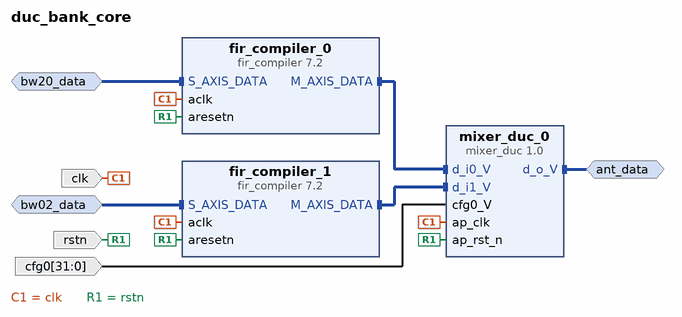
[diagram p0: block diagram of the top level]
# Vivado block design duc_bank_core, xc7z045ffg900-2, Vivado 2017.4.1
create_bd_design duc_bank_core

create_bd_intf_port -mode Slave -vlnv xilinx.com:interface:axis_rtl:1.0 bw20_data
set_property -dict [list \
  CONFIG.TDATA_NUM_BYTES 8 \
  CONFIG.TDEST_WIDTH 0 \
  CONFIG.TID_WIDTH 0 \
  CONFIG.TUSER_WIDTH 0 \
  CONFIG.HAS_TREADY 1 \
  CONFIG.HAS_TSTRB 0 \
  CONFIG.HAS_TKEEP 0 \
  CONFIG.HAS_TLAST 0 \
  CONFIG.FREQ_HZ 200000000 \
  CONFIG.LAYERED_METADATA undef \
] [get_bd_intf_ports bw20_data]
create_bd_intf_port -mode Slave -vlnv xilinx.com:interface:axis_rtl:1.0 bw02_data
set_property -dict [list \
  CONFIG.TDATA_NUM_BYTES 16 \
  CONFIG.TDEST_WIDTH 0 \
  CONFIG.TID_WIDTH 0 \
  CONFIG.TUSER_WIDTH 0 \
  CONFIG.HAS_TREADY 1 \
  CONFIG.HAS_TSTRB 0 \
  CONFIG.HAS_TKEEP 0 \
  CONFIG.HAS_TLAST 0 \
  CONFIG.FREQ_HZ 200000000 \
  CONFIG.LAYERED_METADATA undef \
] [get_bd_intf_ports bw02_data]
create_bd_intf_port -mode Master -vlnv xilinx.com:interface:acc_fifo_write_rtl:1.0 ant_data
create_bd_port -dir I -type clk clk
set_property -dict {CONFIG.FREQ_HZ 200000000 CONFIG.ASSOCIATED_BUSIF bw20_data:bw02_data} [get_bd_ports clk]
create_bd_port -dir I -type rst rstn
create_bd_port -dir I -from 31 -to 0 -type data cfg0
set_property -dict [list \
  CONFIG.LAYERED_METADATA {xilinx.com:interface:datatypes:1.0 {DATA {datatype {name {attribs {resolve_type immediate dependency {} format string minimum {} maximum {}} value {}} bitwidth {attribs {resolve_type immediate dependency {} format long minimum {} maximum {}} value 32} bitoffset {attribs {resolve_type immediate dependency {} format long minimum {} maximum {}} value 0} integer {signed {attribs {resolve_type immediate dependency {} format bool minimum {} maximum {}} value true}}}}}} \
] [get_bd_ports cfg0]

create_bd_cell -type ip -vlnv xilinx.com:ip:fir_compiler:7.2 fir_compiler_0
set_property -dict [list \
  CONFIG.CoefficientVector 235,-37,-181,-98,130,118,-169,-257,74,315,-2,-418,-181,429,371,-409,-637,256,899,12,-1183,-499,1424,1309,-1631,-2989,1754,10259,14579,10259,1754,-2989,-1631,1309,1424,-499,-1183,12,899,256,-637,-409,371,429,-181,-418,-2,315,74,-257,-169,118,130,-98,-181,-37,235 \
  CONFIG.Coefficient_Sets 1 \
  CONFIG.Filter_Type Interpolation \
  CONFIG.Interpolation_Rate 2 \
  CONFIG.Decimation_Rate 1 \
  CONFIG.Zero_Pack_Factor 1 \
  CONFIG.Number_Channels 1 \
  CONFIG.Number_Paths 4 \
  CONFIG.RateSpecification Output_Sample_Period \
  CONFIG.SamplePeriod 4 \
  CONFIG.Sample_Frequency 0.001 \
  CONFIG.Clock_Frequency 300.0 \
  CONFIG.Coefficient_Sign Signed \
  CONFIG.Quantization Integer_Coefficients \
  CONFIG.Coefficient_Width 16 \
  CONFIG.Coefficient_Fractional_Bits 0 \
  CONFIG.Coefficient_Structure Symmetric \
  CONFIG.Data_Width 16 \
  CONFIG.Output_Rounding_Mode Symmetric_Rounding_to_Infinity \
  CONFIG.Output_Width 16 \
  CONFIG.Filter_Architecture Systolic_Multiply_Accumulate \
  CONFIG.ColumnConfig 4 \
  CONFIG.M_DATA_Has_TREADY true \
  CONFIG.Has_ARESETn true \
] [get_bd_cells fir_compiler_0]
create_bd_cell -type ip -vlnv xilinx.com:ip:fir_compiler:7.2 fir_compiler_1
set_property -dict [list \
  CONFIG.CoefficientVector 67,41,48,51,50,43,29,10,-15,-43,-71,-97,-117,-127,-125,-109,-78,-33,23,86,150,208,252,276,274,243,179,87,-31,-164,-302,-432,-537,-602,-615,-562,-438,-237,36,375,766,1191,1628,2053,2443,2775,3027,3185,3239,3185,3027,2775,2443,2053,1628,1191,766,375,36,-237,-438,-562,-615,-602,-537,-432,-302,-164,-31,87,179,243,274,276,252,208,150,86,23,-33,-78,-109,-125,-127,-117,-97,-71,-43,-15,10,29,43,50,51,48,41,67 \
  CONFIG.Coefficient_Sets 1 \
  CONFIG.Filter_Type Interpolation \
  CONFIG.Interpolation_Rate 20 \
  CONFIG.Decimation_Rate 1 \
  CONFIG.Zero_Pack_Factor 1 \
  CONFIG.Number_Channels 1 \
  CONFIG.Number_Paths 4 \
  CONFIG.RateSpecification Output_Sample_Period \
  CONFIG.SamplePeriod 4 \
  CONFIG.Sample_Frequency 0.001 \
  CONFIG.Clock_Frequency 300.0 \
  CONFIG.Coefficient_Sign Signed \
  CONFIG.Quantization Integer_Coefficients \
  CONFIG.Coefficient_Width 16 \
  CONFIG.Coefficient_Fractional_Bits 0 \
  CONFIG.Coefficient_Structure Symmetric \
  CONFIG.Output_Rounding_Mode Symmetric_Rounding_to_Infinity \
  CONFIG.Output_Width 16 \
  CONFIG.Filter_Architecture Systolic_Multiply_Accumulate \
  CONFIG.ColumnConfig 1 \
  CONFIG.M_DATA_Has_TREADY true \
  CONFIG.Has_ARESETn true \
] [get_bd_cells fir_compiler_1]
create_bd_cell -type ip -vlnv xilinx.com:hls:mixer_duc:1.0 mixer_duc_0

# ---- connections ----

connect_bd_intf_net [get_bd_intf_pins fir_compiler_0/M_AXIS_DATA] [get_bd_intf_pins mixer_duc_0/d_i0_V]
connect_bd_intf_net [get_bd_intf_pins fir_compiler_1/M_AXIS_DATA] [get_bd_intf_pins mixer_duc_0/d_i1_V]
connect_bd_intf_net -intf_net wifi_data_1 [get_bd_intf_ports bw20_data] [get_bd_intf_pins fir_compiler_0/S_AXIS_DATA]
connect_bd_intf_net -intf_net zigbee_data_1 [get_bd_intf_ports bw02_data] [get_bd_intf_pins fir_compiler_1/S_AXIS_DATA]
connect_bd_intf_net [get_bd_intf_ports ant_data] [get_bd_intf_pins mixer_duc_0/d_o_V]
connect_bd_net [get_bd_ports clk] [get_bd_pins fir_compiler_0/aclk] [get_bd_pins fir_compiler_1/aclk] [get_bd_pins mixer_duc_0/ap_clk]
connect_bd_net [get_bd_ports rstn] [get_bd_pins fir_compiler_1/aresetn] [get_bd_pins fir_compiler_0/aresetn] [get_bd_pins mixer_duc_0/ap_rst_n]
connect_bd_net -net cfg0_1 [get_bd_ports cfg0] [get_bd_pins mixer_duc_0/cfg0_V]

validate_bd_design
save_bd_design
